# Altium schematic sheet Power Supply.SchDoc
size 431 x 279 mm; SheetNumber: 5; SheetTotal: 6
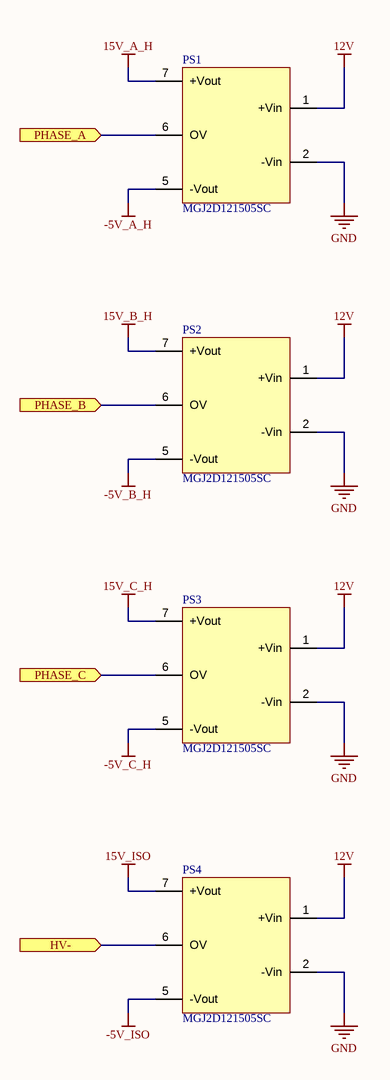
[diagram p0: Power Supply.SchDoc]

## Parts
PS1  MGJ2D121505SC
PS2  MGJ2D121505SC
PS3  MGJ2D121505SC
PS4  MGJ2D121505SC

## Ports
HV- (in), PHASE_A (in), PHASE_B (in), PHASE_C (in)

## Nets
12V: PS1.1(+Vin) PS2.1(+Vin) PS3.1(+Vin) PS4.1(+Vin)
15V_A_H: PS1.7(+Vout)
15V_B_H: PS2.7(+Vout)
15V_C_H: PS3.7(+Vout)
15V_ISO: PS4.7(+Vout)
-5V_A_H: PS1.5(-Vout)
-5V_B_H: PS2.5(-Vout)
-5V_C_H: PS3.5(-Vout)
-5V_ISO: PS4.5(-Vout)
GND: PS1.2(-Vin) PS2.2(-Vin) PS3.2(-Vin) PS4.2(-Vin)
HV-: PS4.6(OV) ; port HV-
PHASE_A: PS1.6(OV) ; port PHASE_A
PHASE_B: PS2.6(OV) ; port PHASE_B
PHASE_C: PS3.6(OV) ; port PHASE_C

## Notes on the sheet
- Title
- Project
- Scale
- Size
- B
- Part Number
- Engineer
- Sheet
- of
- Rev

## Library data of the parts
PS1-PS4 = MGJ2D121505SC: DC DC CONVERTER 15V -5V 2W